# EAGLE design PCB-CARR-CMB-1and2 (EAGLE 6.5.0)

## Sheet 1 of 2
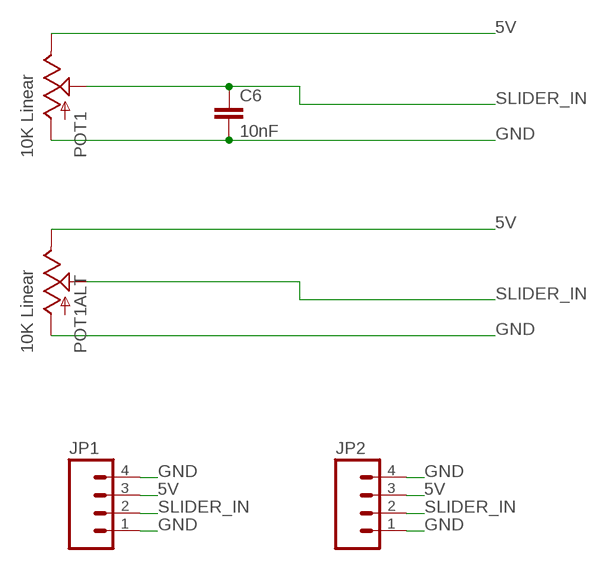
[diagram p0: schematic, sheet 1]

### Parts
C6  10nF  CAP0603-CAP  [0603-CAP]
JP1  M04PTH  [1X04]
JP2  M04PTH  [1X04]
POT1  10K Linear  SLIDER20  [SLIDER20]
POT1ALT  10K Linear  SLIDER20  [SLIDER20]

### Nets
5V [Power]: JP1.3 JP2.3 POT1.1(E) POT1ALT.1(E)
GND [Power]: C6.2 JP1.1 JP1.4 JP2.1 JP2.4 POT1.3(A) POT1ALT.3(A)
SLIDER_IN: C6.1 JP1.2 JP2.2 POT1.2A(S) POT1ALT.2A(S)

## Sheet 2 of 2

## Library data of the parts
C6 = SparkFun:CAP: Capacitor Standard 0603 ceramic capacitor, and 0.1" leaded capacitor.
JP1 JP2 = SparkFun:M04: Header 4 Standard 4-pin 0.1" header. Use with straight break away headers (SKU : PRT-00116), right angle break away headers (PRT-00553), swiss pins (PRT-00743), machine pins (PRT-00117), and female headers (PRT-00115). Molex polarized connector foot print use with SKU : PRT-08231 with associated crimp pins and housings. 1MM SMD Version SKU: PRT-10208
POT1 POT1ALT = SKAARHOJ:SLIDER

## Net classes
0 default: width 0.203 mm, drill 0.406 mm, clearance 0.203 mm
1 Power: width 0.406 mm, drill 0.61 mm, clearance 0.203 mm

## Board
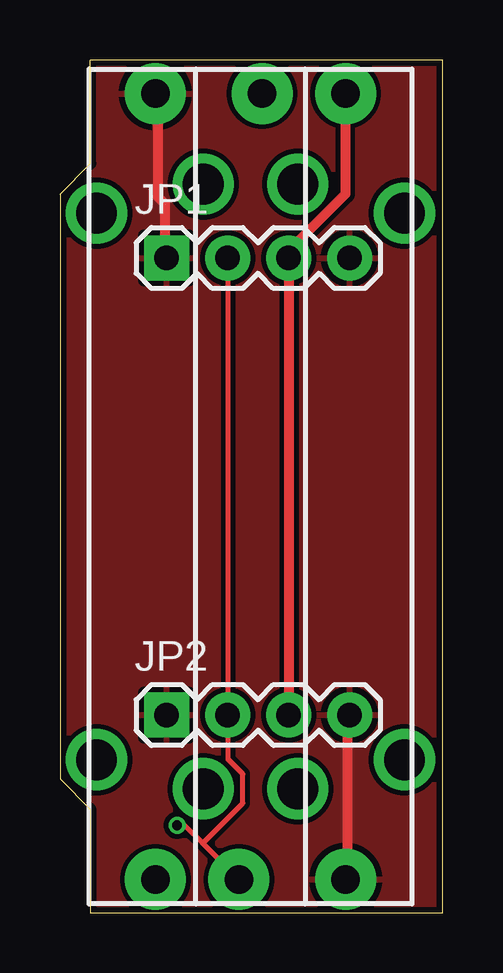
[diagram p1: board, top side]
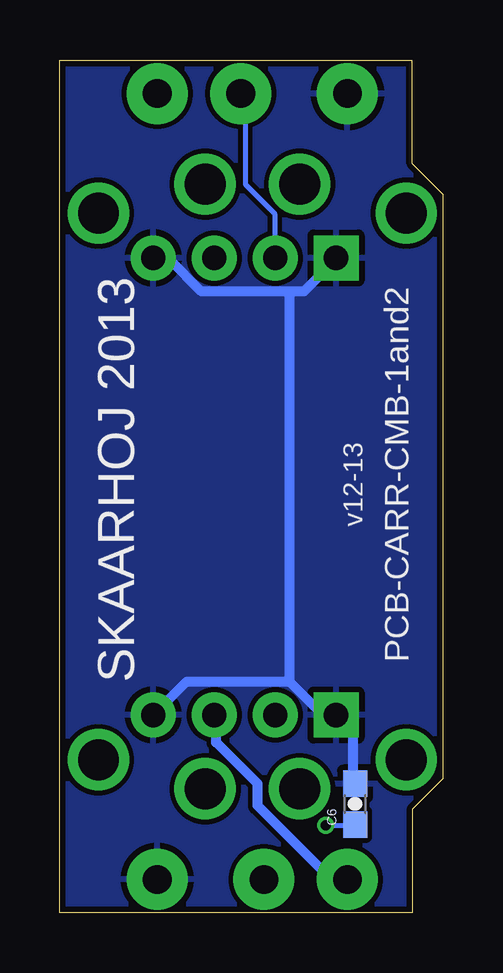
[diagram p2: board, bottom side, seen from below]

Size 15.95 x 35.56 mm. Coordinates in mm from the lower left corner, seen from the top.
Outline: 1.27,0 15.95,0 15.95,35.56 1.27,35.56 1.27,31.24 0,29.97 0,5.59 1.27,4.32 1.27,0
Copper layers (1*16): Top 0.035mm / dielectric 1.5mm / Bottom 0.035mm
Design rules "Fusion_eagle_rule_v1.1": minimum track width 6mil, minimum drill 12mil, track to track 6mil, track to pad 6mil, pad to pad 6mil, via to via 6mil, smd to smd 0mil, copper to edge 10mil, drill to drill 10mil, minimum pad ring 10mil, minimum via ring 6mil, stop-mask expansion 2mil, vias tented up to drill 100mil, thermal gap 10mil

### Footprints (pad centres in the part's own frame; a part is rotated, then mirrored left to right if it is on the bottom)
0603-CAP = smd 1.1 x 1: 1 -0.85,0; 2 0.85,0
1X04 = drill 1.016 pad 1.88 square: 1 0,0 | drill 1.016 pad 1.88: 2 2.54,0; 3 5.08,0; 4 7.62,0
SLIDER20 = drill 1.194 pad 2.54: 1 -16.383,1.74; 2A -16.383,-1.74; 3 16.383,1.74 | drill 1.702: P$1 -11.392,4.191; P$2 11.392,4.191; P$3 12.598,-4.191; P$4 -12.598,-4.191

### Placement (x,y rotation side)
C6  3.66,4.54 90 bottom
JP1  4.45,27.3 0 top
JP2  4.45,8.26 0 top
POT1  5.71,17.78 90 top
POT1ALT  10.16,17.78 270 top

### Tracks (layer width: path | path; a pad name or v marks a point on that pad's centre or on a via)
5V
  Top 0.406: POT1ALT.1 11.89,34.14 11.89,29.97 9.55,27.64 9.55,27.33 JP1.3 9.55,27.13 9.55,8.33 JP2.3
  Bottom 0.406: JP2.3 9.45,8.23 9.45,7.11 7.72,5.38 7.72,4.47 4.67,1.42 4.06,1.42 POT1.1
GND
  Top 0.406: JP2.4 11.99,8.23 11.99,1.42 POT1ALT.3 | JP1.1 4.37,27.33 4.37,29.57 4.06,29.87 4.06,34.14 POT1.3
  Bottom 0.406: C6.2 3.76,5.49 3.76,7.62 4.37,8.23 JP2.1 4.57,8.33 5.08,8.33 6.4,9.65 | 6.4,9.65 10.67,9.65 JP2.4 | 6.4,25.91 5.79,25.91 4.47,27.23 JP1.1 | 6.4,25.91 10.06,25.91 11.38,27.23 11.99,27.23 JP1.4 | 6.4,25.91 6.4,9.65
  pour Top: 0,0 16.51,0 16.51,35.56 0,35.56
  pour Bottom: 0,0 16.51,0 16.51,35.56 0,35.56
SLIDER_IN  (via drill 0.41)
  Top 0.203: v4.88,3.66 5.18,3.66 5.94,2.9 | 5.94,2.9 7.42,1.42 POT1.2A | 5.94,2.9 7.62,4.57 7.62,5.79 7.01,6.4 7.01,8.23 JP2.2 7.01,8.33 7.01,27.23 JP1.2
  Bottom 0.203: JP1.2 7.01,27.33 7.01,29.16 8.23,30.38 8.23,34.04 8.33,34.14 POT1ALT.2A | v4.88,3.66 3.76,3.66 C6.1

### Text on the board
_bsilk: SKAARHOJ 2013 | PCB-CARR-CMB-1and2 | v12-13